# EasyEDA schematic SCH_SMARTWATCH-pcb.json
TITLE: Safe Baby Watch; REV: 1.0; Date: 2024-10-07; Sheet: 1/1; Company: IOT AND SENSOR NETWORKS
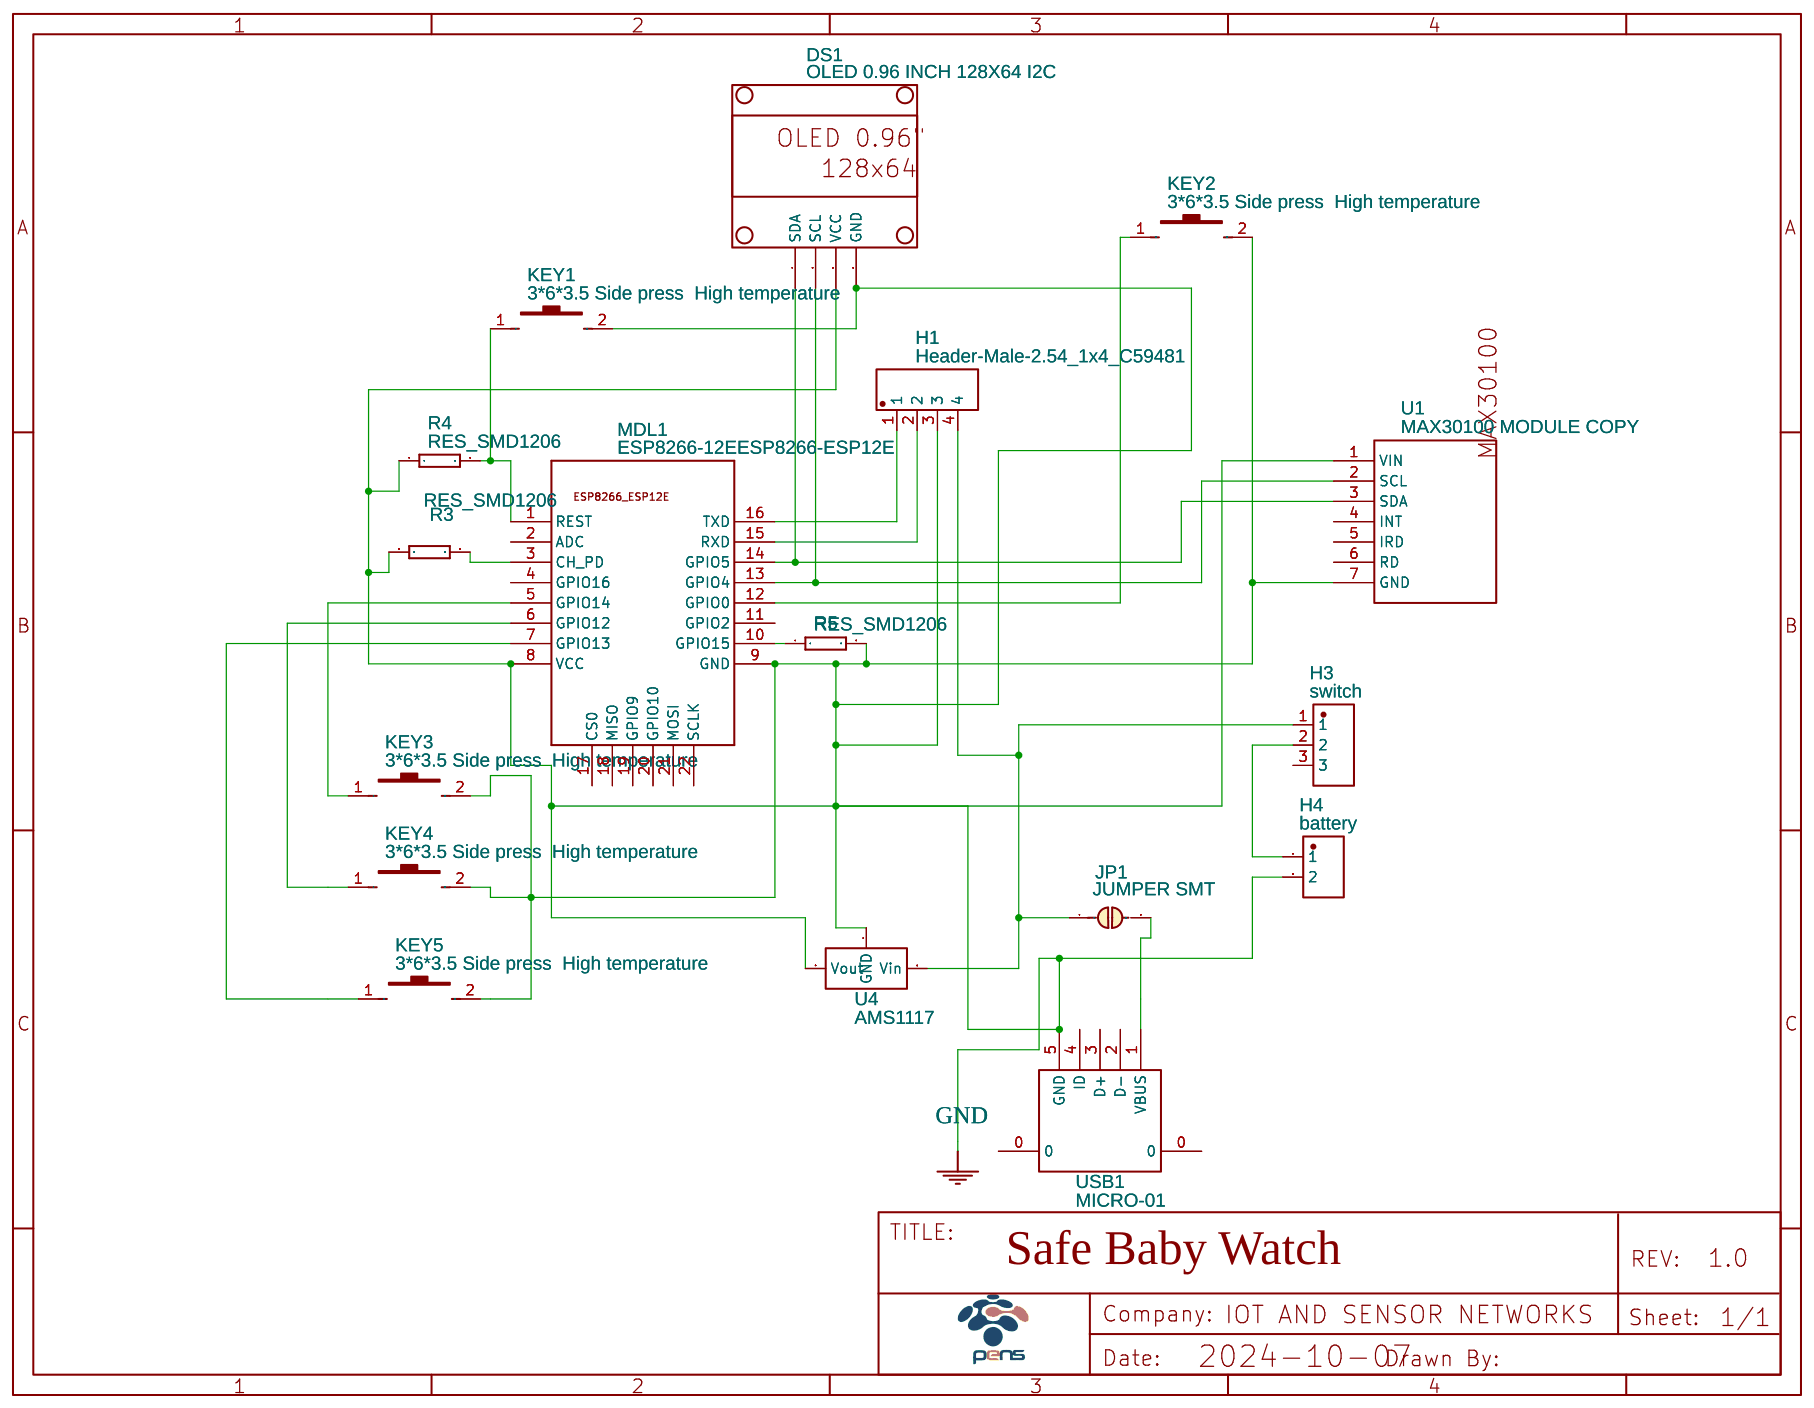
[diagram p0: schematic sheet]

## Parts
DS1  OLED 0.96 INCH 128X64 I2C  [OLED 0.96 INCH 128X64 I2C]
H1  Header-Male-2.54_1x4_C59481  [HDR-TH_4P-P2.54-V-M]
H3  switch  [HDR-TH_03P-P2.54-V-M]
H4  battery  [HDR-TH_2P-P2.54-V-M]
JP1  JUMPER SMT  [JUMPERS_SMT-JUMPER_2_NC_PASTE_NO-SILK]
KEY1  3*6*3.5 Side press  High temperature  [SW-SMD_C37327]
KEY2  3*6*3.5 Side press  High temperature  [SW-SMD_C37327]
KEY3  3*6*3.5 Side press  High temperature  [SW-SMD_C37327]
KEY4  3*6*3.5 Side press  High temperature  [SW-SMD_C37327]
KEY5  3*6*3.5 Side press  High temperature  [SW-SMD_C37327]
MDL1  ESP8266-12EESP8266-ESP12E  [ESP8266-ESP12E]
R3  RES_SMD1206  [RESISTOR_SMD1206]
R4  RES_SMD1206  [RESISTOR_SMD1206]
R5  RES_SMD1206  [RESISTOR_SMD1206]
U1  MAX30100 MODULE COPY  [MAX30100_MODULE]
U4  AMS1117  [AMS1117]
USB1  MICRO-01  [MICRO-USB_MICRO-USB-32]

## Library data of the parts
DS1 = OLED 0.96 INCH 128X64 I2C: Contributor: Mihir_Lad
H1 = Header-Male-2.54_1x4_C59481: Supplier: LCSC; Manufacturer: ReliaPro; Manufacturer Part: Headers  Pins 1*4P; Supplier Part: C59481
H3 = PZ254-1-03-Z-8.5: Supplier: LCSC; Supplier Part: C2894926; Manufacturer: HCTL(华灿天禄); Contributor: LCSC; Package Display: No
H4 = MH254V-11-02-1000: Supplier: LCSC; Supplier Part: C2889980; Manufacturer: XFCN(台湾兴飞); Contributor: LCSC; Package Display: No
JP1 = JUMPER SMT: Contributor: CanMarques
KEY1-KEY5 = 3*6*3.5 Side press  High temperature: Supplier: LCSC; Manufacturer: ReliaPro; Supplier Part: C37327
MDL1 = ESP8266-12EESP8266-ESP12E: Contributor: ggdups
R3-R5 = RES_SMD1206: Manufacturer Part: 10K; Contributor: VGarankin
U1 = MAX30100 MODULE COPY: link: https://www.aliexpress.com/item/32810459983.html?spm=a2g0o.detail.1000014.15.214c142fA81ZN8&gps-id=pcDetailBottomMoreOtherSeller&scm=1007.13338.136874&scm_id=1007.13338.136874&scm-url=1007.13338.136874&pvid=a0309ad8-d53b-48bd-8c58-b77e664b8125; Contributor: nataliacaroline0717
U4 = AMS1117: Supplier: Amish; Supplier Part: HLK-PM01; Contributor: Gremlinware
USB1 = MICRO-01: Supplier: LCSC; Supplier Part: C183609; Manufacturer: SOFNG; Manufacturer Part: Micro-01; Contributor: LCSC; JLCPCB Part Class: Extended Part

## Nets
GND: DS1.1(GND) DS1.2(VCC) H1.3 H4.2 KEY1.2 KEY2.2 KEY3.2 KEY4.2 KEY5.2 MDL1.8(VCC) MDL1.9(GND) R3.1 R4.1 R5.2 U1.1(VIN) U1.7(GND) U4.1(GND) U4.2(Vout) USB1.5(GND)
Net-(DS1-3): DS1.3(SCL) MDL1.13(GPIO4) U1.2(SCL)
Net-(DS1-4): DS1.4(SDA) MDL1.14(GPIO5) U1.3(SDA)
Net-(H1-1): H1.1 MDL1.16(TXD)
Net-(H1-2): H1.2 MDL1.15(RXD)
Net-(H1-4): H1.4 H3.1 JP1.1 U4.3(Vin)
Net-(H3-2): H3.2 H4.1
Net-(JP1-2): JP1.2 USB1.1(VBUS)
Net-(KEY1-1): KEY1.1 MDL1.1(REST) R4.2
Net-(KEY2-1): KEY2.1 MDL1.12(GPIO0)
Net-(KEY3-1): KEY3.1 MDL1.5(GPIO14)
Net-(KEY4-1): KEY4.1 MDL1.6(GPIO12)
Net-(KEY5-1): KEY5.1 MDL1.7(GPIO13)
Net-(MDL1-3): MDL1.3(CH_PD) R3.2
Net-(MDL1-10): MDL1.10(GPIO15) R5.1

Not connected (* = marked no-connect by the designer): H3 3; MDL1 2(ADC) 4(GPIO16) 11(GPIO2) 17(CS0) 18(MISO) 19(GPIO9) 20(GPIO10) 21(MOSI) 22(SCLK); U1 4(INT) 5(IRD) 6(RD); USB1 0 2(D-) 3(D+) 4(ID)
